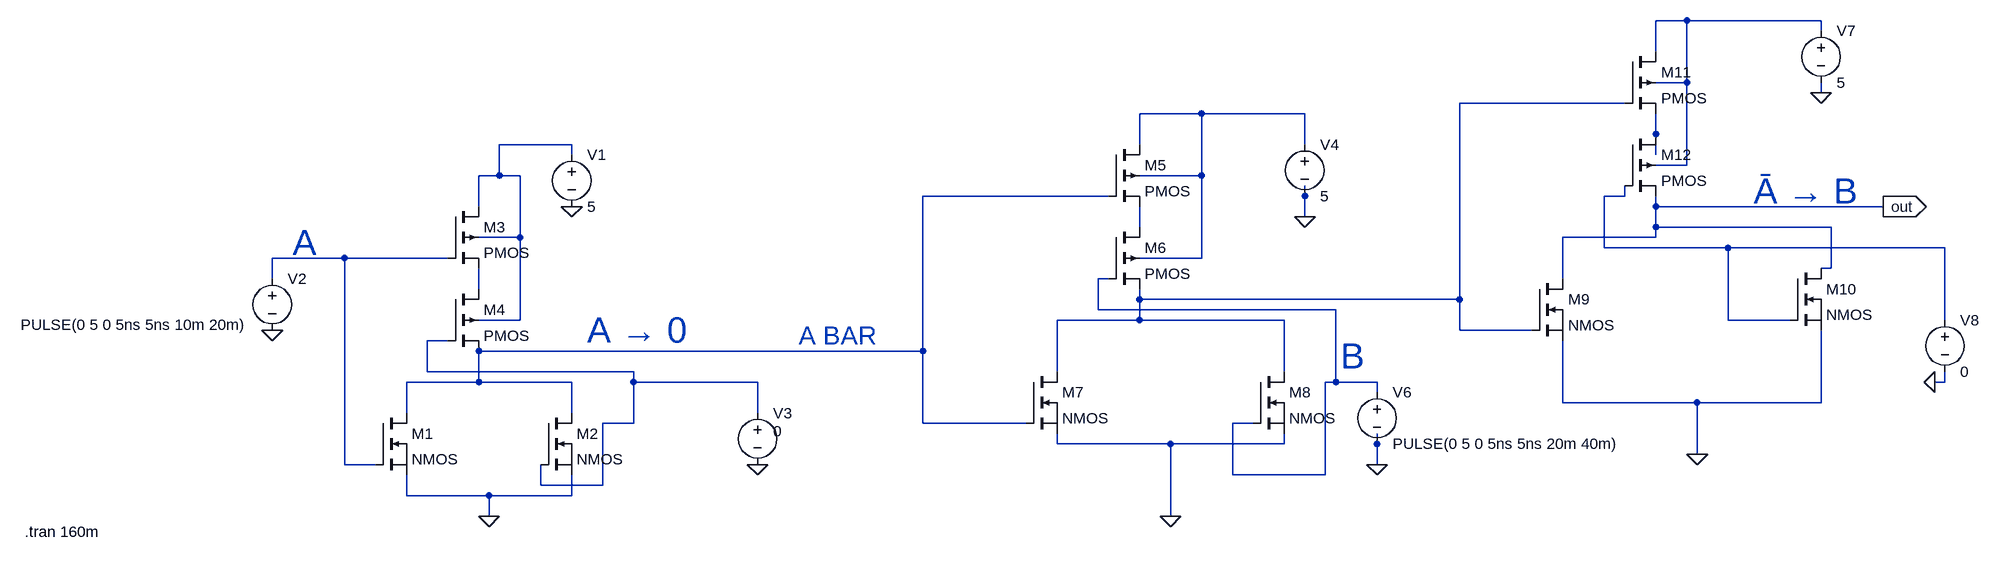
[diagram p0: schematic originalimplygate.asc]
originalimplygate.asc, the LTspice schematic file:
Version 4
SHEET 1 2424 680
WIRE 1968 -352 1920 -352
WIRE 2176 -352 1968 -352
WIRE 2176 -336 2176 -352
WIRE 1920 -304 1920 -352
WIRE 1968 -256 1968 -352
WIRE 1968 -256 1920 -256
WIRE 2176 -240 2176 -256
WIRE 1872 -224 1616 -224
WIRE 1216 -208 1120 -208
WIRE 1376 -208 1216 -208
WIRE 1920 -176 1920 -208
WIRE 240 -160 128 -160
WIRE 1120 -160 1120 -208
WIRE 1376 -160 1376 -208
WIRE 240 -144 240 -160
WIRE 1920 -144 1920 -176
WIRE 1968 -128 1968 -256
WIRE 1968 -128 1920 -128
WIRE 128 -112 128 -160
WIRE 128 -112 96 -112
WIRE 160 -112 128 -112
WIRE 1216 -112 1216 -208
WIRE 1216 -112 1120 -112
WIRE 1072 -80 784 -80
WIRE 1376 -80 1376 -96
WIRE 1872 -80 1872 -96
WIRE 1872 -80 1840 -80
WIRE 96 -64 96 -112
WIRE 1920 -64 1920 -80
WIRE 2272 -64 1920 -64
WIRE 1376 -48 1376 -80
WIRE 1120 -32 1120 -64
WIRE 1920 -32 1920 -64
WIRE 2192 -32 1920 -32
WIRE 160 -16 160 -112
WIRE 160 -16 96 -16
WIRE 1920 -16 1920 -32
WIRE 1920 -16 1776 -16
WIRE 1840 0 1840 -80
WIRE 2032 0 1840 0
WIRE 2368 0 2032 0
WIRE -112 16 -224 16
WIRE 48 16 -112 16
WIRE 1216 16 1216 -112
WIRE 1216 16 1120 16
WIRE 2192 32 2192 -32
WIRE 2192 32 2176 32
WIRE -224 48 -224 16
WIRE 1072 48 1056 48
WIRE 1776 48 1776 -16
WIRE 96 64 96 32
WIRE 1120 80 1120 64
WIRE 1616 80 1616 -224
WIRE 1616 80 1120 80
WIRE 1056 96 1056 48
WIRE 1424 96 1056 96
WIRE 160 112 160 -16
WIRE 160 112 96 112
WIRE 1120 112 1120 80
WIRE 1120 112 992 112
WIRE 1344 112 1120 112
WIRE 2032 112 2032 0
WIRE 2128 112 2032 112
WIRE 2368 112 2368 0
WIRE 1616 128 1616 80
WIRE 1728 128 1616 128
WIRE 48 144 16 144
WIRE 784 160 784 -80
WIRE 784 160 96 160
WIRE 16 192 16 144
WIRE 336 192 16 192
WIRE 992 192 992 112
WIRE 1344 192 1344 112
WIRE 96 208 96 160
WIRE 96 208 -16 208
WIRE 240 208 96 208
WIRE 336 208 336 192
WIRE 528 208 336 208
WIRE 1424 208 1424 96
WIRE 1424 208 1408 208
WIRE 1488 208 1424 208
WIRE 2368 208 2368 192
WIRE 2368 208 2352 208
WIRE 1488 224 1488 208
WIRE 1776 240 1776 144
WIRE 1984 240 1776 240
WIRE 2176 240 2176 128
WIRE 2176 240 1984 240
WIRE -16 256 -16 208
WIRE 240 256 240 208
WIRE 528 256 528 208
WIRE 336 272 336 208
WIRE 336 272 288 272
WIRE 784 272 784 160
WIRE 944 272 784 272
WIRE 1296 272 1264 272
WIRE 992 304 992 288
WIRE 1168 304 992 304
WIRE 1344 304 1344 288
WIRE 1344 304 1168 304
WIRE 1488 304 1488 288
WIRE 1984 320 1984 240
WIRE -112 336 -112 16
WIRE -64 336 -112 336
WIRE 1488 336 1488 304
WIRE 1264 352 1264 272
WIRE 1408 352 1408 208
WIRE 1408 352 1264 352
WIRE 192 368 192 336
WIRE 288 368 288 272
WIRE 288 368 192 368
WIRE -16 384 -16 352
WIRE 112 384 -16 384
WIRE 240 384 240 352
WIRE 240 384 112 384
WIRE 112 416 112 384
WIRE 1168 416 1168 304
FLAG 528 336 0
FLAG 112 416 0
FLAG -224 128 0
FLAG 240 -64 0
FLAG 1168 416 0
FLAG 1376 -48 0
FLAG 1488 336 0
FLAG 2176 -240 0
FLAG 1984 320 0
FLAG 2352 208 0
FLAG 2272 -64 out
IOPIN 2272 -64 Out
SYMBOL nmos -64 256 R0
SYMATTR InstName M1
SYMBOL nmos 192 256 R0
SYMATTR InstName M2
SYMBOL pmos4 48 -64 R0
SYMATTR InstName M3
SYMBOL pmos4 48 64 R0
SYMATTR InstName M4
SYMBOL voltage 240 -160 R0
WINDOW 123 0 0 Left 0
WINDOW 39 0 0 Left 0
SYMATTR InstName V1
SYMATTR Value 5
SYMBOL voltage -224 32 R0
WINDOW 123 0 0 Left 0
WINDOW 39 0 0 Left 0
WINDOW 3 -390 87 Left 2
SYMATTR InstName V2
SYMATTR Value PULSE(0 5 0 5ns 5ns 10m 20m)
SYMBOL voltage 528 240 R0
WINDOW 3 24 44 Left 2
WINDOW 123 0 0 Left 0
WINDOW 39 0 0 Left 0
SYMATTR Value 0
SYMATTR InstName V3
SYMBOL pmos4 1072 -160 R0
SYMATTR InstName M5
SYMBOL pmos4 1072 -32 R0
SYMATTR InstName M6
SYMBOL nmos 944 192 R0
SYMATTR InstName M7
SYMBOL nmos 1296 192 R0
SYMATTR InstName M8
SYMBOL voltage 1376 -176 R0
WINDOW 123 0 0 Left 0
WINDOW 39 0 0 Left 0
SYMATTR InstName V4
SYMATTR Value 5
SYMBOL voltage 1488 208 R0
WINDOW 123 0 0 Left 0
WINDOW 39 0 0 Left 0
SYMATTR InstName V6
SYMATTR Value PULSE(0 5 0 5ns 5ns 20m 40m)
SYMBOL nmos 1728 48 R0
SYMATTR InstName M9
SYMBOL nmos 2128 32 R0
SYMATTR InstName M10
SYMBOL voltage 2176 -352 R0
WINDOW 123 0 0 Left 0
WINDOW 39 0 0 Left 0
SYMATTR InstName V7
SYMATTR Value 5
SYMBOL voltage 2368 96 R0
WINDOW 123 0 0 Left 0
WINDOW 39 0 0 Left 0
SYMATTR InstName V8
SYMATTR Value 0
SYMBOL pmos4 1872 -304 R0
SYMATTR InstName M11
SYMBOL pmos4 1872 -176 R0
SYMATTR InstName M12
TEXT -192 -8 Left 5 ;A
TEXT 264 128 Left 5 ;A → 0
TEXT 592 136 Left 4 ;A BAR
TEXT 1432 168 Left 5 ;B
TEXT 2072 -88 Left 5 ;Ā → B
TEXT -608 440 Left 2 !.tran 160m

The netlist it stands for:
* originalimplygate.asc
M1 N006 N009 0 0 NMOS
M2 N006 N012 0 0 NMOS
M3 N005 N009 N011 N005 PMOS
M4 N011 N012 N006 N005 PMOS
V1 N005 0 5
V2 N009 0 PULSE(0 5 0 5ns 5ns 10m 20m)
V3 N012 0 0
M5 N003 N006 N008 N003 PMOS
M6 N008 N010 N002 N003 PMOS
M7 N002 N006 0 0 NMOS
M8 N002 N010 0 0 NMOS
V4 N003 0 5
V6 N010 0 PULSE(0 5 0 5ns 5ns 20m 40m)
M9 out N002 0 0 NMOS
M10 out N007 0 0 NMOS
V7 N001 0 5
V8 N007 0 0
M11 N001 N002 N004 N001 PMOS
M12 N004 N007 out N001 PMOS
.model NMOS NMOS
.model PMOS PMOS
.lib standard.mos
* A
* A → 0
* A BAR
* B
* Ā → B
.tran 160m
.backanno
.end